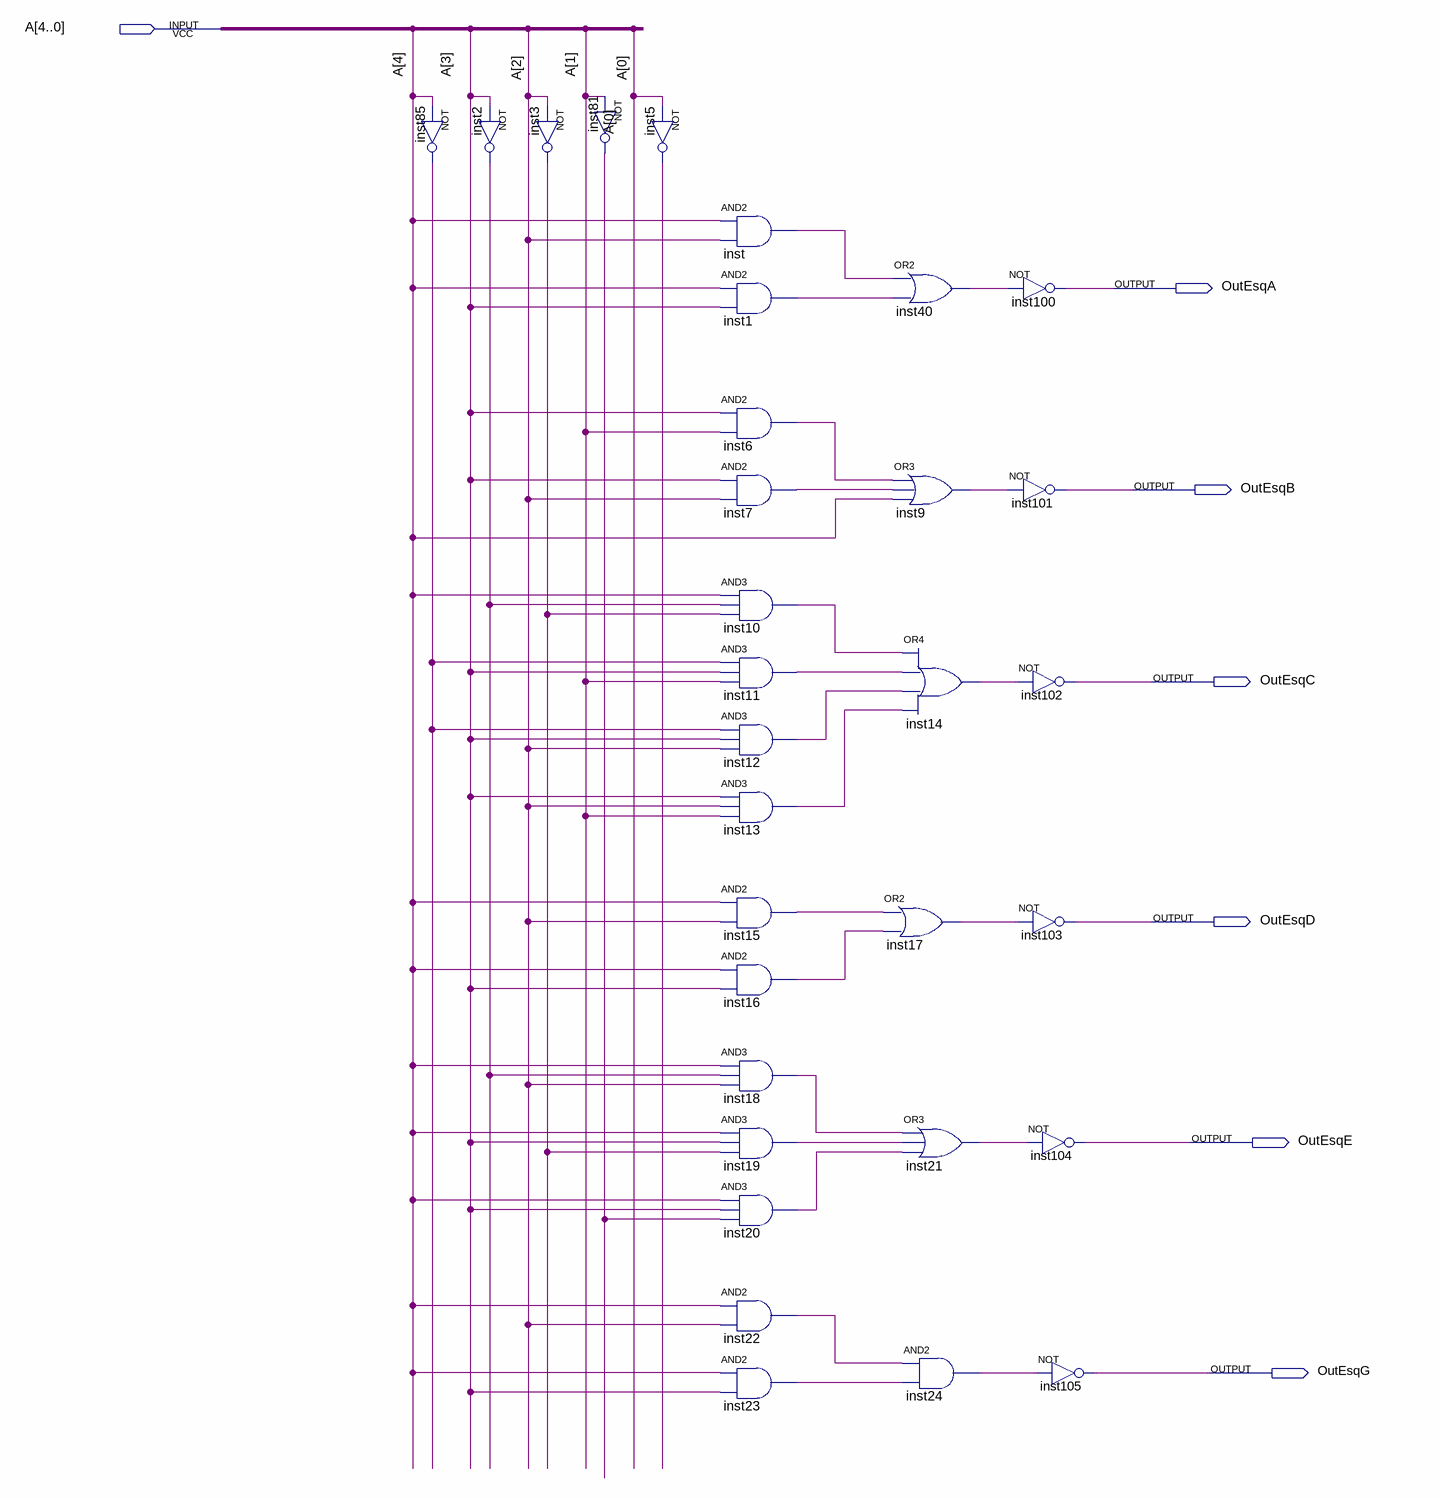
[diagram p0: schematic sheet]
// Quartus schematic DisplayEsqSaida.bdf as structural Verilog: 32 symbols, 7 pins
module DisplayEsqSaida (
  input  [4:0] A,
  output OutEsqA,
  output OutEsqB,
  output OutEsqC,
  output OutEsqD,
  output OutEsqE,
  output OutEsqG
);

  wire inst1_out, inst2_out, inst3_out, inst5_out, inst6_out, inst7_out, inst9_out, inst10_out, inst11_out,
       inst12_out, inst13_out, inst14_out, inst15_out, inst16_out, inst17_out, inst18_out, inst19_out,
       inst20_out, inst21_out, inst22_out, inst23_out, inst24_out, inst40_out, inst81_out, inst85_out,
       inst_out;

  not inst85 (inst85_out, A[4]);
  not inst2 (inst2_out, A[3]);
  not inst3 (inst3_out, A[2]);
  not inst81 (inst81_out, A[1]);
  not inst5 (inst5_out, A[0]);
  and inst (inst_out, A[4], A[2]);
  and inst1 (inst1_out, A[4], A[3]);
  and inst6 (inst6_out, A[3], A[1]);
  and inst7 (inst7_out, A[3], A[2]);
  and inst10 (inst10_out, A[4], inst2_out, inst3_out);
  and inst11 (inst11_out, inst85_out, A[3], A[1]);
  and inst12 (inst12_out, inst85_out, A[3], A[2]);
  and inst13 (inst13_out, A[3], A[2], A[1]);
  and inst15 (inst15_out, A[4], A[2]);
  and inst16 (inst16_out, A[4], A[3]);
  and inst18 (inst18_out, A[4], inst2_out, A[2]);
  and inst19 (inst19_out, A[4], A[3], inst3_out);
  and inst20 (inst20_out, A[4], A[3], inst81_out);
  and inst22 (inst22_out, A[4], A[2]);
  and inst23 (inst23_out, A[4], A[3]);
  or inst40 (inst40_out, inst_out, inst1_out);
  or inst9 (inst9_out, inst6_out, inst7_out, A[4]);
  or inst14 (inst14_out, inst10_out, inst11_out, inst12_out, inst13_out);
  or inst17 (inst17_out, inst15_out, inst16_out);
  or inst21 (inst21_out, inst18_out, inst19_out, inst20_out);
  and inst24 (inst24_out, inst22_out, inst23_out);
  not inst100 (OutEsqA, inst40_out);
  not inst101 (OutEsqB, inst9_out);
  not inst102 (OutEsqC, inst14_out);
  not inst103 (OutEsqD, inst17_out);
  not inst104 (OutEsqE, inst21_out);
  not inst105 (OutEsqG, inst24_out);
endmodule
